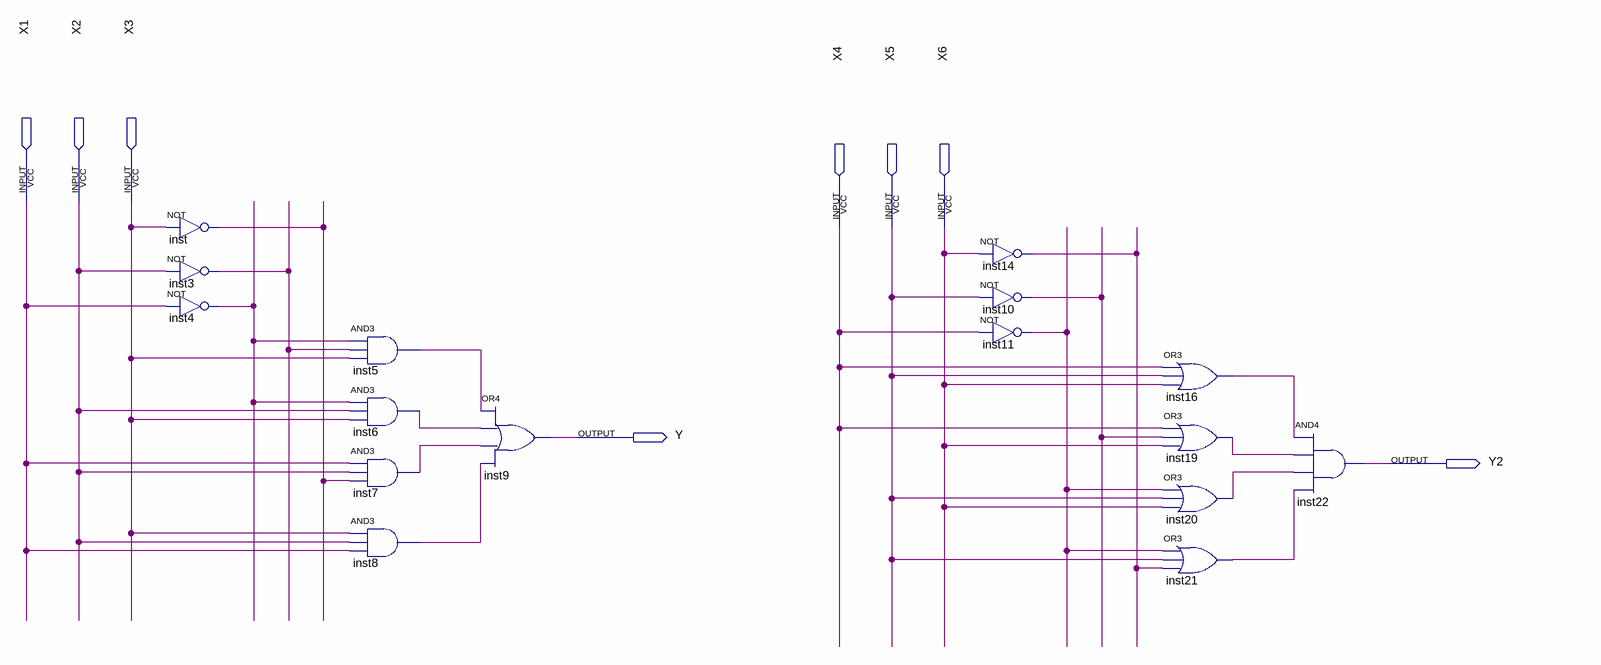
[diagram p0: schematic sheet]
// Quartus schematic lab2.bdf as structural Verilog: 16 symbols, 8 pins
module lab2 (
  input  X1,
  input  X2,
  input  X3,
  input  X4,
  input  X5,
  input  X6,
  output Y,
  output Y2
);

  wire inst3_out, inst4_out, inst5_out, inst6_out, inst7_out, inst8_out, inst10_out, inst11_out, inst14_out,
       inst16_out, inst19_out, inst20_out, inst21_out, inst_out;

  not inst (inst_out, X3);
  not inst3 (inst3_out, X2);
  not inst4 (inst4_out, X1);
  and inst5 (inst5_out, inst4_out, inst3_out, X3);
  and inst6 (inst6_out, inst4_out, X2, X3);
  and inst7 (inst7_out, X1, X2, inst_out);
  and inst8 (inst8_out, X3, X2, X1);
  or inst9 (Y, inst5_out, inst6_out, inst7_out, inst8_out);
  not inst14 (inst14_out, X6);
  not inst10 (inst10_out, X5);
  not inst11 (inst11_out, X4);
  or inst16 (inst16_out, X4, X5, X6);
  or inst19 (inst19_out, X4, inst10_out, X6);
  or inst20 (inst20_out, inst11_out, X5, X6);
  or inst21 (inst21_out, inst11_out, X5, inst14_out);
  and inst22 (Y2, inst16_out, inst19_out, inst20_out, inst21_out);
endmodule
